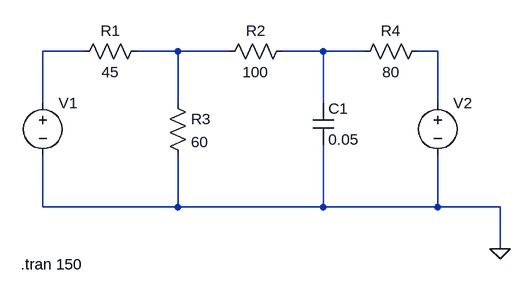
[diagram p0: schematic Draft3.asc]
Draft3.asc, the LTspice schematic file:
Version 4
SHEET 1 892 680
WIRE 48 128 -16 128
WIRE 192 128 128 128
WIRE 272 128 192 128
WIRE 416 128 352 128
WIRE 480 128 416 128
WIRE 592 128 560 128
WIRE -16 208 -16 128
WIRE 192 208 192 128
WIRE 416 208 416 128
WIRE 592 208 592 128
WIRE -16 368 -16 288
WIRE 192 368 192 288
WIRE 192 368 -16 368
WIRE 416 368 416 272
WIRE 416 368 192 368
WIRE 592 368 592 288
WIRE 592 368 416 368
WIRE 688 368 592 368
WIRE 688 432 688 368
FLAG 688 432 0
SYMBOL cap 400 208 R0
SYMATTR InstName C1
SYMATTR Value 0.05
SYMBOL res 144 112 R90
WINDOW 0 0 56 VBottom 2
WINDOW 3 32 56 VTop 2
SYMATTR InstName R1
SYMATTR Value 45
SYMBOL res 368 112 R90
WINDOW 0 0 56 VBottom 2
WINDOW 3 32 56 VTop 2
SYMATTR InstName R2
SYMATTR Value 100
SYMBOL res 176 192 R0
SYMATTR InstName R3
SYMATTR Value 60
SYMBOL res 576 112 R90
WINDOW 0 0 56 VBottom 2
WINDOW 3 32 56 VTop 2
SYMATTR InstName R4
SYMATTR Value 80
SYMBOL voltage -16 192 R0
WINDOW 3 24 96 Invisible 2
WINDOW 123 0 0 Left 0
WINDOW 39 0 0 Left 0
SYMATTR InstName V1
SYMATTR Value PULSE(10 0 20 1f 1f 200)
SYMBOL voltage 592 192 R0
WINDOW 3 24 96 Invisible 2
WINDOW 123 0 0 Left 0
WINDOW 39 0 0 Left 0
SYMATTR InstName V2
SYMATTR Value PULSE(0 5 20 1f 1f 200)
TEXT -50 456 Left 2 !.tran 150

The netlist it stands for:
* Draft3.asc
C1 N003 0 0.05
R1 N002 N001 45
R2 N003 N002 100
R3 N002 0 60
R4 N004 N003 80
V1 N001 0 PULSE(10 0 20 1f 1f 200)
V2 N004 0 PULSE(0 5 20 1f 1f 200)
.tran 150
.backanno
.end